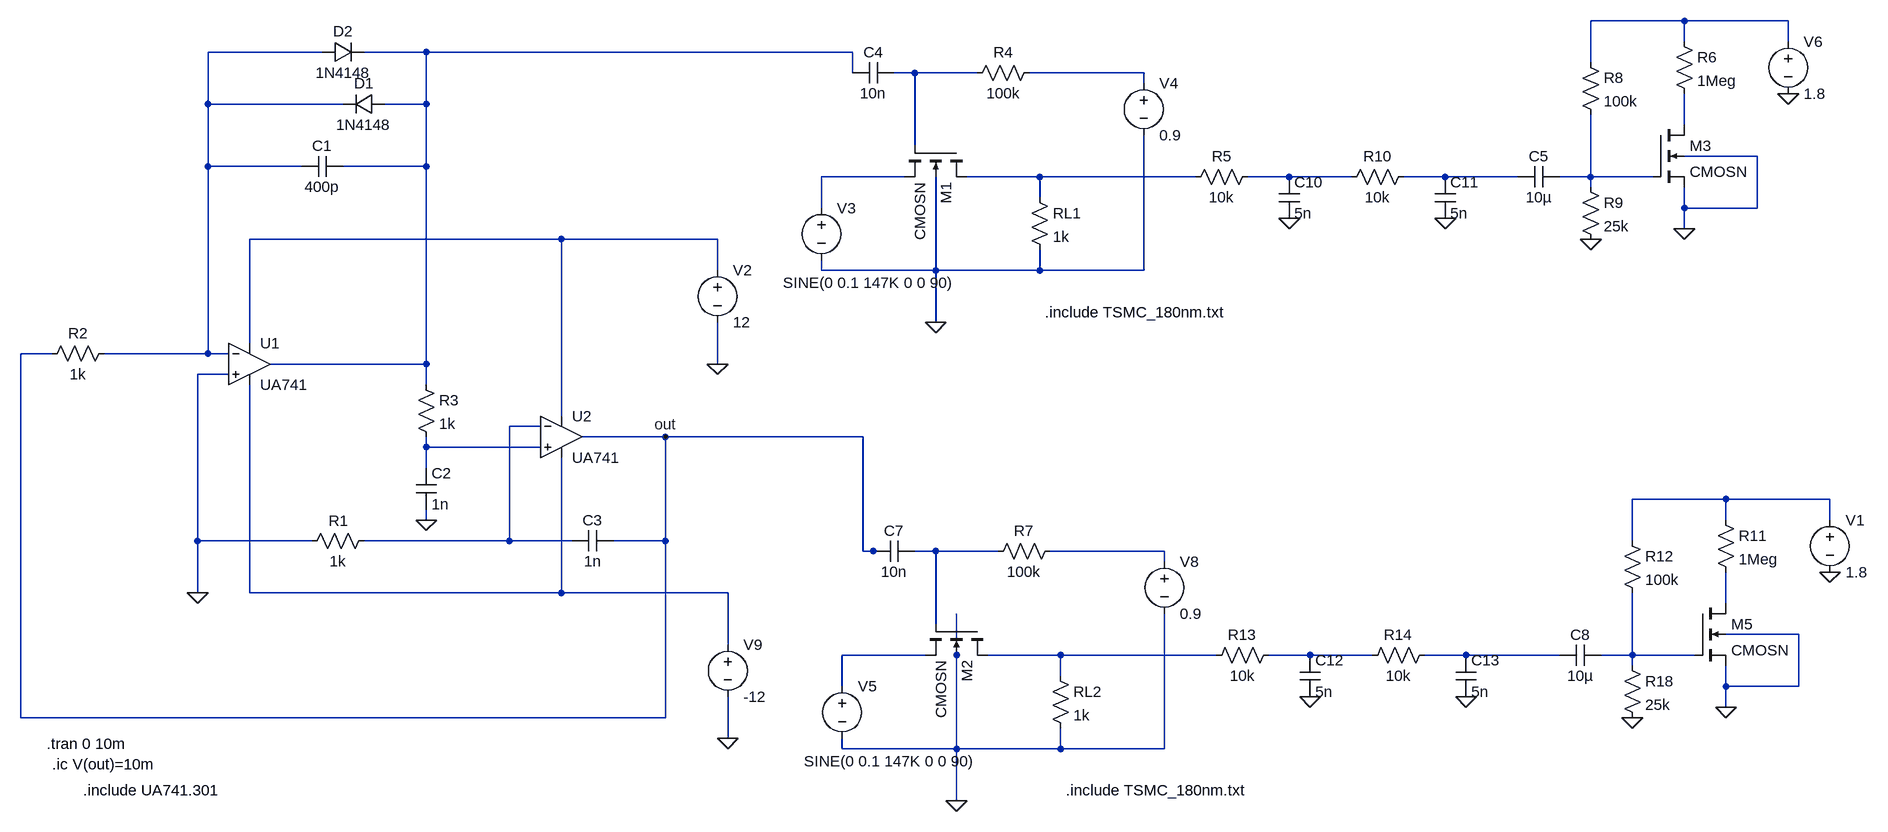
[diagram p0: schematic QDC.asc]
QDC.asc, the LTspice schematic file:
Version 4.1
SHEET 1 2752 1360
WIRE 2176 -368 2032 -368
WIRE 2336 -368 2176 -368
WIRE 2176 -336 2176 -368
WIRE 2336 -336 2336 -368
WIRE 80 -320 -96 -320
WIRE 240 -320 144 -320
WIRE 896 -320 240 -320
WIRE 2032 -304 2032 -368
WIRE 896 -288 896 -320
WIRE 992 -288 960 -288
WIRE 1088 -288 992 -288
WIRE 1344 -288 1168 -288
WIRE 1344 -272 1344 -288
WIRE -96 -240 -96 -320
WIRE 112 -240 -96 -240
WIRE 240 -240 240 -320
WIRE 240 -240 176 -240
WIRE 2176 -208 2176 -256
WIRE 992 -176 992 -288
WIRE 2288 -160 2176 -160
WIRE -96 -144 -96 -240
WIRE 48 -144 -96 -144
WIRE 240 -144 240 -240
WIRE 240 -144 112 -144
WIRE 976 -128 848 -128
WIRE 1184 -128 1072 -128
WIRE 1424 -128 1184 -128
WIRE 1568 -128 1504 -128
WIRE 1664 -128 1568 -128
WIRE 1808 -128 1744 -128
WIRE 1920 -128 1808 -128
WIRE 2032 -128 2032 -224
WIRE 2032 -128 1984 -128
WIRE 2128 -128 2032 -128
WIRE 2032 -112 2032 -128
WIRE 1184 -96 1184 -128
WIRE 848 -80 848 -128
WIRE 2176 -80 2176 -112
WIRE 2288 -80 2288 -160
WIRE 2288 -80 2176 -80
WIRE 2176 -48 2176 -80
WIRE 448 -32 -32 -32
WIRE 688 -32 448 -32
WIRE 688 16 688 -32
WIRE 848 16 848 0
WIRE 1024 16 1024 -128
WIRE 1024 16 848 16
WIRE 1184 16 1184 -16
WIRE 1184 16 1024 16
WIRE 1344 16 1344 -192
WIRE 1344 16 1184 16
WIRE 1024 96 1024 16
WIRE -32 128 -32 -32
WIRE -336 144 -384 144
WIRE -96 144 -96 -144
WIRE -96 144 -256 144
WIRE -64 144 -96 144
WIRE 240 160 240 -144
WIRE 240 160 0 160
WIRE 688 160 688 96
WIRE -64 176 -112 176
WIRE 240 192 240 160
WIRE 448 240 448 -32
WIRE 416 256 368 256
WIRE 608 272 480 272
WIRE 912 272 608 272
WIRE 240 288 240 272
WIRE 416 288 240 288
WIRE 240 320 240 288
WIRE 2240 368 2096 368
WIRE 2400 368 2240 368
WIRE 240 400 240 384
WIRE 2240 400 2240 368
WIRE 2400 400 2400 368
WIRE -112 432 -112 176
WIRE 64 432 -112 432
WIRE 368 432 368 256
WIRE 368 432 144 432
WIRE 464 432 368 432
WIRE 608 432 608 272
WIRE 608 432 528 432
WIRE 2096 432 2096 368
WIRE 912 448 912 272
WIRE 928 448 912 448
WIRE 944 448 928 448
WIRE 1024 448 992 448
WIRE 1120 448 1024 448
WIRE 1376 448 1200 448
WIRE 1376 464 1376 448
WIRE -112 512 -112 432
WIRE -32 512 -32 192
WIRE 448 512 448 304
WIRE 448 512 -32 512
WIRE 704 512 448 512
WIRE 2240 528 2240 480
WIRE 1024 560 1024 448
WIRE 2352 576 2240 576
WIRE 704 592 704 512
WIRE 1008 608 880 608
WIRE 1056 608 1056 544
WIRE 1216 608 1104 608
WIRE 1456 608 1216 608
WIRE 1600 608 1536 608
WIRE 1696 608 1600 608
WIRE 1840 608 1776 608
WIRE 1984 608 1840 608
WIRE 2096 608 2096 512
WIRE 2096 608 2048 608
WIRE 2192 608 2096 608
WIRE 2096 624 2096 608
WIRE 1216 640 1216 608
WIRE 880 656 880 608
WIRE 2240 656 2240 624
WIRE 2352 656 2352 576
WIRE 2352 656 2240 656
WIRE 2240 688 2240 656
WIRE -384 704 -384 144
WIRE 608 704 608 432
WIRE 608 704 -384 704
WIRE 704 736 704 672
WIRE 880 752 880 736
WIRE 1056 752 1056 608
WIRE 1056 752 880 752
WIRE 1216 752 1216 720
WIRE 1216 752 1056 752
WIRE 1376 752 1376 544
WIRE 1376 752 1216 752
WIRE 1056 832 1056 752
FLAG 1024 96 0
FLAG 240 400 0
FLAG 688 160 0
FLAG 704 736 0
FLAG 608 272 out
FLAG 1056 832 0
FLAG 1568 -64 0
FLAG 1808 -64 0
FLAG 1600 672 0
FLAG 1840 672 0
FLAG 2336 -256 0
FLAG 2176 -48 0
FLAG 2032 -32 0
FLAG -112 512 0
FLAG 2400 480 0
FLAG 2240 688 0
FLAG 2096 704 0
SYMBOL cap 960 -304 R90
WINDOW 0 0 32 VBottom 2
WINDOW 3 32 32 VTop 2
SYMATTR InstName C4
SYMATTR Value 10n
SYMBOL res 1184 -304 R90
WINDOW 0 0 56 VBottom 2
WINDOW 3 32 56 VTop 2
SYMATTR InstName R4
SYMATTR Value 100k
SYMBOL nmos4 1072 -176 R90
SYMATTR InstName M1
SYMATTR Value CMOSN
SYMATTR Value2 l=0.18u w=1.8u ad=0.81u as=0.81u pd=4.5u ps=4.5u m=1
SYMBOL res 1168 -112 R0
SYMATTR InstName RL1
SYMATTR Value 1k
SYMBOL voltage 848 -96 R0
WINDOW 123 0 0 Left 0
WINDOW 39 0 0 Left 0
WINDOW 3 -59 131 Left 2
SYMATTR Value SINE(0 0.1 147K 0 0 90)
SYMATTR InstName V3
SYMBOL voltage 1344 -288 R0
SYMATTR InstName V4
SYMATTR Value 0.9
SYMBOL res 1520 -144 R90
WINDOW 0 0 56 VBottom 2
WINDOW 3 32 56 VTop 2
SYMATTR InstName R5
SYMATTR Value 10k
SYMBOL cap 112 -160 R90
WINDOW 0 0 32 VBottom 2
WINDOW 3 32 32 VTop 2
SYMATTR InstName C1
SYMATTR Value 400p
SYMBOL res 160 416 R90
WINDOW 0 1 55 VBottom 2
WINDOW 3 32 56 VTop 2
SYMATTR InstName R1
SYMATTR Value 1k
SYMBOL res -240 128 R90
WINDOW 0 0 56 VBottom 2
WINDOW 3 32 56 VTop 2
SYMATTR InstName R2
SYMATTR Value 1k
SYMBOL res 224 176 R0
SYMATTR InstName R3
SYMATTR Value 1k
SYMBOL cap 224 320 R0
SYMATTR InstName C2
SYMATTR Value 1n
SYMBOL cap 528 416 R90
WINDOW 0 0 32 VBottom 2
WINDOW 3 32 32 VTop 2
SYMATTR InstName C3
SYMATTR Value 1n
SYMBOL voltage 688 0 R0
WINDOW 123 0 0 Left 0
WINDOW 39 0 0 Left 0
SYMATTR InstName V2
SYMATTR Value 12
SYMBOL voltage 704 576 R0
WINDOW 123 0 0 Left 0
WINDOW 39 0 0 Left 0
SYMATTR InstName V9
SYMATTR Value -12
SYMBOL OpAmps\\opamp2 -32 96 R0
SYMATTR InstName U1
SYMATTR Value UA741
SYMBOL OpAmps\\opamp2 448 208 R0
SYMATTR InstName U2
SYMATTR Value UA741
SYMBOL diode 176 -256 R90
WINDOW 0 0 32 VBottom 2
WINDOW 3 32 32 VTop 2
SYMATTR InstName D1
SYMATTR Value 1N4148
SYMBOL diode 80 -304 R270
WINDOW 0 32 32 VTop 2
WINDOW 3 0 32 VBottom 2
SYMATTR InstName D2
SYMATTR Value 1N4148
SYMBOL cap 992 432 R90
WINDOW 0 0 32 VBottom 2
WINDOW 3 32 32 VTop 2
SYMATTR InstName C7
SYMATTR Value 10n
SYMBOL res 1216 432 R90
WINDOW 0 0 56 VBottom 2
WINDOW 3 32 56 VTop 2
SYMATTR InstName R7
SYMATTR Value 100k
SYMBOL nmos4 1104 560 R90
SYMATTR InstName M2
SYMATTR Value CMOSN
SYMATTR Value2 l=0.18u w=1.8u ad=0.81u as=0.81u pd=4.5u ps=4.5u m=1
SYMBOL res 1200 624 R0
SYMATTR InstName RL2
SYMATTR Value 1k
SYMBOL voltage 880 640 R0
WINDOW 123 0 0 Left 0
WINDOW 39 0 0 Left 0
WINDOW 3 -59 131 Left 2
SYMATTR Value SINE(0 0.1 147K 0 0 90)
SYMATTR InstName V5
SYMBOL voltage 1376 448 R0
SYMATTR InstName V8
SYMATTR Value 0.9
SYMBOL cap 1552 -128 R0
SYMATTR InstName C10
SYMATTR Value 5n
SYMBOL res 1760 -144 R90
WINDOW 0 0 56 VBottom 2
WINDOW 3 32 56 VTop 2
SYMATTR InstName R10
SYMATTR Value 10k
SYMBOL cap 1792 -128 R0
SYMATTR InstName C11
SYMATTR Value 5n
SYMBOL res 1552 592 R90
WINDOW 0 0 56 VBottom 2
WINDOW 3 32 56 VTop 2
SYMATTR InstName R13
SYMATTR Value 10k
SYMBOL cap 1584 608 R0
SYMATTR InstName C12
SYMATTR Value 5n
SYMBOL res 1792 592 R90
WINDOW 0 0 56 VBottom 2
WINDOW 3 32 56 VTop 2
SYMATTR InstName R14
SYMATTR Value 10k
SYMBOL cap 1824 608 R0
SYMATTR InstName C13
SYMATTR Value 5n
SYMBOL nmos4 2128 -208 R0
SYMATTR InstName M3
SYMATTR Value2 l=0.18u w=18u ad=8.1p as=8.1p pd=36.9u ps=36.9u m=1
SYMATTR Value CMOSN
SYMBOL res 2160 -352 R0
SYMATTR InstName R6
SYMATTR Value 1Meg
SYMBOL voltage 2336 -352 R0
SYMATTR InstName V6
SYMATTR Value 1.8
SYMBOL res 2016 -320 R0
SYMATTR InstName R8
SYMATTR Value 100k
SYMBOL res 2016 -128 R0
SYMATTR InstName R9
SYMATTR Value 25k
SYMBOL cap 1984 -144 R90
WINDOW 0 0 32 VBottom 2
WINDOW 3 32 32 VTop 2
SYMATTR InstName C5
SYMATTR Value 10µ
SYMBOL nmos4 2192 528 R0
SYMATTR InstName M5
SYMATTR Value2 l=0.18u w=18u ad=8.1p as=8.1p pd=36.9u ps=36.9u m=1
SYMATTR Value CMOSN
SYMBOL res 2224 384 R0
SYMATTR InstName R11
SYMATTR Value 1Meg
SYMBOL voltage 2400 384 R0
SYMATTR InstName V1
SYMATTR Value 1.8
SYMBOL res 2080 416 R0
SYMATTR InstName R12
SYMATTR Value 100k
SYMBOL res 2080 608 R0
SYMATTR InstName R18
SYMATTR Value 25k
SYMBOL cap 2048 592 R90
WINDOW 0 0 32 VBottom 2
WINDOW 3 32 32 VTop 2
SYMATTR InstName C8
SYMATTR Value 10µ
TEXT 1192 80 Left 2 !.include TSMC_180nm.txt
TEXT -344 744 Left 2 !.tran 0 10m
TEXT -336 776 Left 2 !.ic V(out)=10m
TEXT -288 816 Left 2 !.include UA741.301
TEXT 1224 816 Left 2 !.include TSMC_180nm.txt

The netlist it stands for:
* QDC.asc
C4 N004 N003 10n
R4 N005 N004 100k
M1 N008 N004 N007 0 CMOSN l=0.18u w=1.8u ad=0.81u as=0.81u pd=4.5u ps=4.5u m=1
RL1 N008 0 1k
V3 N007 0 SINE(0 0.1 147K 0 0 90)
V4 N005 0 0.9
R5 N009 N008 10k
C1 N003 N002 400p
R1 N013 0 1k
R2 N002 out 1k
R3 N003 N014 1k
C2 N014 0 1n
C3 out N013 1n
V2 N012 0 12
V9 N018 0 -12
X§U1 0 N002 N012 N018 N003 UA741  ; pins In+ In- V+ V- OUT
X§U2 N014 N013 N012 N018 out UA741  ; pins In+ In- V+ V- OUT
D1 N003 N002 1N4148
D2 N002 N003 1N4148
C7 N016 out 10n
R7 N017 N016 100k
M2 N021 N016 N020 0 CMOSN l=0.18u w=1.8u ad=0.81u as=0.81u pd=4.5u ps=4.5u m=1
RL2 N021 0 1k
V5 N020 0 SINE(0 0.1 147K 0 0 90)
V8 N017 0 0.9
C10 N009 0 5n
R10 N010 N009 10k
C11 N010 0 5n
R13 N022 N021 10k
C12 N022 0 5n
R14 N023 N022 10k
C13 N023 0 5n
M3 N006 N011 0 0 CMOSN l=0.18u w=18u ad=8.1p as=8.1p pd=36.9u ps=36.9u m=1
R6 N001 N006 1Meg
V6 N001 0 1.8
R8 N001 N011 100k
R9 N011 0 25k
C5 N011 N010 10µ
M5 N019 N024 0 0 CMOSN l=0.18u w=18u ad=8.1p as=8.1p pd=36.9u ps=36.9u m=1
R11 N015 N019 1Meg
V1 N015 0 1.8
R12 N015 N024 100k
R18 N024 0 25k
C8 N024 N023 10µ
.model D D
.lib standard.dio
.model NMOS NMOS
.model PMOS PMOS
.lib standard.mos
.include TSMC_180nm.txt
.tran 0 10m
.ic V(out)=10m
.include UA741.301
.include TSMC_180nm.txt
.backanno
.end